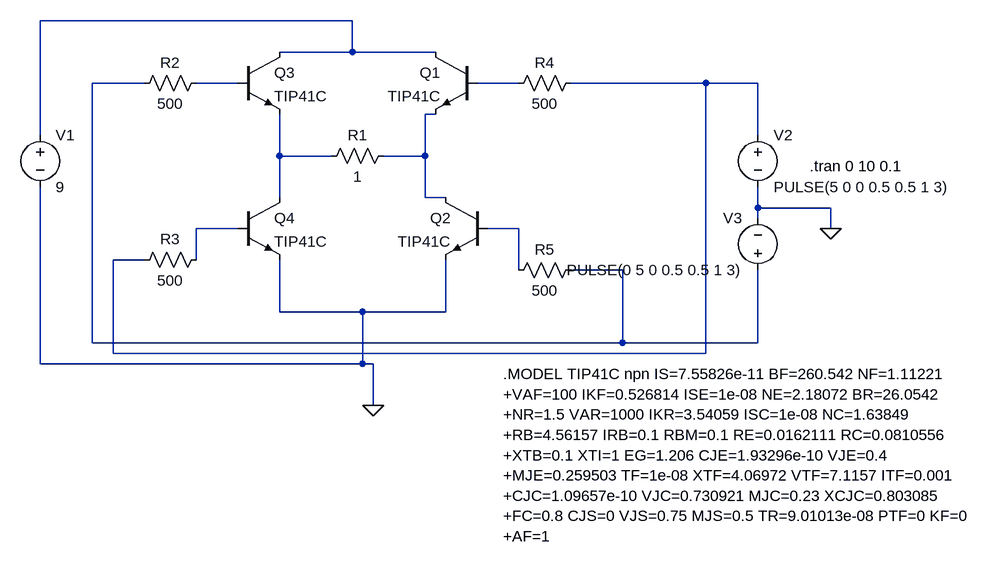
[diagram p0: schematic H-bridge.asc]
H-bridge.asc, the LTspice schematic file:
Version 4
SHEET 1 1244 768
WIRE 272 32 -208 32
WIRE 272 80 272 32
WIRE 272 80 160 80
WIRE 400 80 272 80
WIRE -48 128 -128 128
WIRE 96 128 32 128
WIRE 528 128 464 128
WIRE 816 128 608 128
WIRE 896 128 816 128
WIRE 400 176 384 176
WIRE -208 208 -208 32
WIRE 896 208 896 128
WIRE 160 240 160 176
WIRE 240 240 160 240
WIRE 384 240 384 176
WIRE 384 240 320 240
WIRE 160 304 160 240
WIRE 384 304 384 240
WIRE 416 304 384 304
WIRE 896 320 896 288
WIRE 1008 320 896 320
WIRE 896 336 896 320
WIRE 96 352 32 352
WIRE 528 352 480 352
WIRE 1008 352 1008 320
WIRE -48 400 -96 400
WIRE 32 400 32 352
WIRE 528 416 528 352
WIRE 688 416 608 416
WIRE 160 480 160 400
WIRE 288 480 160 480
WIRE 416 480 416 400
WIRE 416 480 288 480
WIRE -128 528 -128 128
WIRE 688 528 688 416
WIRE 688 528 -128 528
WIRE 896 528 896 416
WIRE 896 528 688 528
WIRE -96 544 -96 400
WIRE 816 544 816 128
WIRE 816 544 -96 544
WIRE -208 560 -208 288
WIRE 288 560 288 480
WIRE 288 560 -208 560
WIRE 304 560 288 560
WIRE 304 624 304 560
FLAG 304 624 0
FLAG 1008 352 0
SYMBOL npn 464 80 M0
SYMATTR InstName Q1
SYMATTR Value TIP41C
SYMBOL npn 480 304 M0
SYMATTR InstName Q2
SYMATTR Value TIP41C
SYMBOL npn 96 80 R0
SYMATTR InstName Q3
SYMATTR Value TIP41C
SYMBOL npn 96 304 R0
SYMATTR InstName Q4
SYMATTR Value TIP41C
SYMBOL res 336 224 R90
WINDOW 0 0 56 VBottom 2
WINDOW 3 32 56 VTop 2
SYMATTR InstName R1
SYMATTR Value 1
SYMBOL voltage -208 192 R0
SYMATTR InstName V1
SYMATTR Value 9
SYMBOL res 48 112 R90
WINDOW 0 0 56 VBottom 2
WINDOW 3 32 56 VTop 2
SYMATTR InstName R2
SYMATTR Value 500
SYMBOL res 48 384 R90
WINDOW 0 0 56 VBottom 2
WINDOW 3 32 56 VTop 2
SYMATTR InstName R3
SYMATTR Value 500
SYMBOL res 624 112 R90
WINDOW 0 0 56 VBottom 2
WINDOW 3 32 56 VTop 2
SYMATTR InstName R4
SYMATTR Value 500
SYMBOL res 624 400 R90
WINDOW 0 0 56 VBottom 2
WINDOW 3 32 56 VTop 2
SYMATTR InstName R5
SYMATTR Value 500
SYMBOL voltage 896 192 R0
SYMATTR InstName V2
SYMATTR Value PULSE(5 0 0 0.5 0.5 1 3)
SYMBOL voltage 896 432 R180
WINDOW 0 24 96 Left 2
WINDOW 3 24 16 Left 2
SYMATTR InstName V3
SYMATTR Value PULSE(0 5 0 0.5 0.5 1 3)
TEXT 976 256 Left 2 !.tran 0 10 0.1
TEXT 504 576 Left 2 !.MODEL TIP41C npn IS=7.55826e-11 BF=260.542 NF=1.11221\n+VAF=100 IKF=0.526814 ISE=1e-08 NE=2.18072 BR=26.0542\n+NR=1.5 VAR=1000 IKR=3.54059 ISC=1e-08 NC=1.63849\n+RB=4.56157 IRB=0.1 RBM=0.1 RE=0.0162111 RC=0.0810556\n+XTB=0.1 XTI=1 EG=1.206 CJE=1.93296e-10 VJE=0.4\n+MJE=0.259503 TF=1e-08 XTF=4.06972 VTF=7.1157 ITF=0.001\n+CJC=1.09657e-10 VJC=0.730921 MJC=0.23 XCJC=0.803085\n+FC=0.8 CJS=0 VJS=0.75 MJS=0.5 TR=9.01013e-08 PTF=0 KF=0\n+AF=1

The netlist it stands for:
* H-bridge.asc
Q1 N001 N004 N006 0 TIP41C
Q2 N006 N009 0 0 TIP41C
Q3 N001 N003 N007 0 TIP41C
Q4 N007 N008 0 0 TIP41C
R1 N006 N007 1
V1 N001 0 9
R2 N003 N002 500
R3 N008 N005 500
R4 N005 N004 500
R5 N002 N009 500
V2 N005 0 PULSE(5 0 0 0.5 0.5 1 3)
V3 N002 0 PULSE(0 5 0 0.5 0.5 1 3)
.model NPN NPN
.model PNP PNP
.lib standard.bjt
.tran 0 10 0.1
.MODEL TIP41C npn IS=7.55826e-11 BF=260.542 NF=1.11221
+VAF=100 IKF=0.526814 ISE=1e-08 NE=2.18072 BR=26.0542
+NR=1.5 VAR=1000 IKR=3.54059 ISC=1e-08 NC=1.63849
+RB=4.56157 IRB=0.1 RBM=0.1 RE=0.0162111 RC=0.0810556
+XTB=0.1 XTI=1 EG=1.206 CJE=1.93296e-10 VJE=0.4
+MJE=0.259503 TF=1e-08 XTF=4.06972 VTF=7.1157 ITF=0.001
+CJC=1.09657e-10 VJC=0.730921 MJC=0.23 XCJC=0.803085
+FC=0.8 CJS=0 VJS=0.75 MJS=0.5 TR=9.01013e-08 PTF=0 KF=0
+AF=1
.backanno
.end